# Altium schematic sheet Main.SchDoc: PCB_Microfono
size A4; Author: Jose Luis Llorente González; CompanyName: ETSIT; Organization: UPM; Revision: V1.0
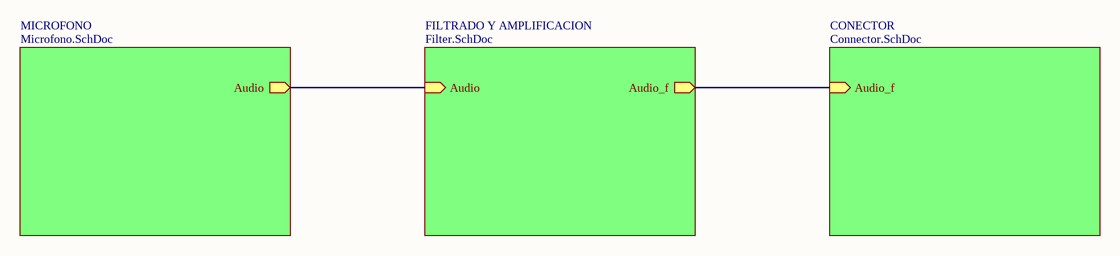
[diagram p0: Main.SchDoc]

## Sub-sheets
CONECTOR = Connector.SchDoc: Audio_f (in)
FILTRADO Y AMPLIFICACION = Filter.SchDoc: Audio (in), Audio_f (out)
MICROFONO = Microfono.SchDoc: Audio (out)

## Nets
(unnamed): sheet MICROFONO/Audio, sheet FILTRADO Y AMPLIFICACION/Audio
(unnamed): sheet FILTRADO Y AMPLIFICACION/Audio_f, sheet CONECTOR/Audio_f

## Notes on the sheet
- Title
- Size:
- Date:
- A4
- Number:
- Time:
- Revision:
- Sheet
- of
- File: